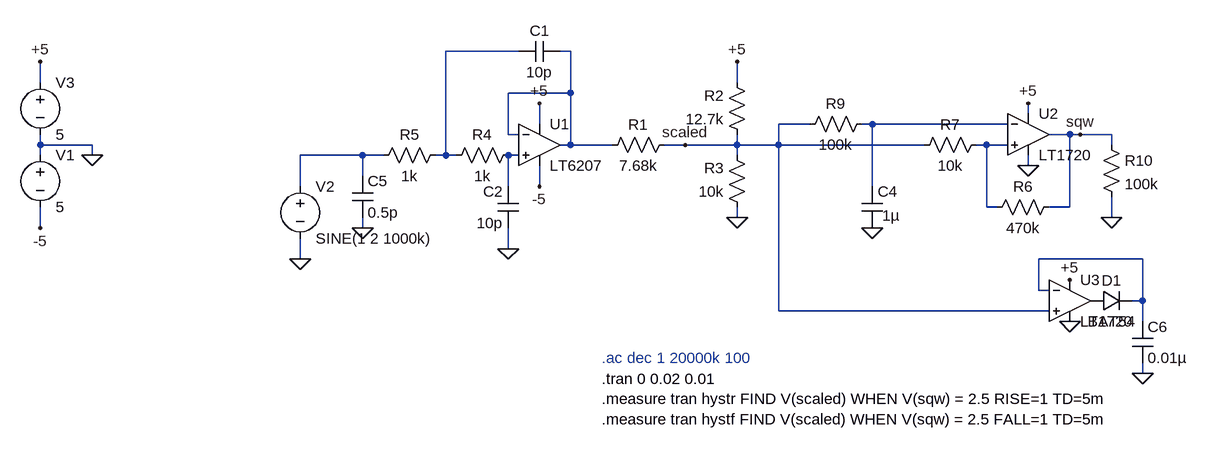
[diagram p0: schematic tsunami input stage.asc]
tsunami input stage.asc, the LTspice schematic file:
Version 4
SHEET 1 1596 724
WIRE 560 160 448 160
WIRE 640 160 624 160
WIRE -176 208 -176 176
WIRE 896 208 896 176
WIRE 640 224 640 160
WIRE 640 224 544 224
WIRE 1344 256 1344 240
WIRE 592 272 592 240
WIRE 1008 272 960 272
WIRE 1104 272 1088 272
WIRE 1312 272 1104 272
WIRE 544 288 544 224
WIRE 560 288 544 288
WIRE 1408 288 1376 288
WIRE 1424 288 1408 288
WIRE 1472 288 1424 288
WIRE -176 304 -176 288
WIRE -96 304 -176 304
WIRE 640 304 640 224
WIRE 640 304 624 304
WIRE 704 304 640 304
WIRE 816 304 784 304
WIRE 896 304 896 288
WIRE 896 304 816 304
WIRE 960 304 960 272
WIRE 960 304 896 304
WIRE 1184 304 960 304
WIRE 1280 304 1264 304
WIRE 1312 304 1280 304
WIRE 1472 304 1472 288
WIRE -176 320 -176 304
WIRE -96 320 -96 304
WIRE 320 320 224 320
WIRE 352 320 320 320
WIRE 448 320 448 160
WIRE 448 320 432 320
WIRE 464 320 448 320
WIRE 560 320 544 320
WIRE 896 320 896 304
WIRE 1344 336 1344 320
WIRE 320 352 320 320
WIRE 224 368 224 320
WIRE 544 368 544 320
WIRE 592 368 592 336
WIRE 1104 368 1104 272
WIRE 1280 400 1280 304
WIRE 1296 400 1280 400
WIRE 1408 400 1408 288
WIRE 1408 400 1376 400
WIRE 896 416 896 400
WIRE 1472 416 1472 384
WIRE -176 432 -176 400
WIRE 320 432 320 416
WIRE 544 464 544 432
WIRE 224 480 224 448
WIRE 1520 480 1360 480
WIRE 1360 528 1360 480
WIRE 1376 528 1360 528
WIRE 1520 544 1520 480
WIRE 1520 544 1504 544
WIRE 960 560 960 304
WIRE 1376 560 960 560
WIRE 1520 576 1520 544
WIRE 1520 656 1520 640
FLAG 224 480 0
FLAG 896 416 0
FLAG -176 176 +5
FLAG -176 432 -5
FLAG -96 320 0
FLAG 896 176 +5
FLAG 592 240 +5
FLAG 592 368 -5
FLAG 544 464 0
FLAG 1344 240 +5
FLAG 1344 336 0
FLAG 1104 432 0
FLAG 1472 416 0
FLAG 320 432 0
FLAG 1520 656 0
FLAG 1408 512 +5
FLAG 1408 576 0
FLAG 816 304 scaled
FLAG 1424 288 sqw
SYMBOL voltage 224 352 R0
SYMATTR InstName V2
SYMATTR Value SINE(1 2 1000k)
SYMATTR Value2 AC 3
SYMBOL res 800 288 R90
WINDOW 0 0 56 VBottom 2
WINDOW 3 32 56 VTop 2
SYMATTR InstName R1
SYMATTR Value 7.68k
SYMBOL res 912 304 R180
WINDOW 0 36 76 Left 2
WINDOW 3 36 40 Left 2
SYMATTR InstName R2
SYMATTR Value 12.7k
SYMBOL res 912 416 R180
WINDOW 0 36 76 Left 2
WINDOW 3 36 40 Left 2
SYMATTR InstName R3
SYMATTR Value 10k
SYMBOL voltage -176 304 R0
SYMATTR InstName V1
SYMATTR Value 5
SYMBOL voltage -176 192 R0
SYMATTR InstName V3
SYMATTR Value 5
SYMBOL Opamps/LT6207 592 304 R0
SYMATTR InstName U1
SYMBOL res 560 304 R90
WINDOW 0 0 56 VBottom 2
WINDOW 3 32 56 VTop 2
SYMATTR InstName R4
SYMATTR Value 1k
SYMBOL res 448 304 R90
WINDOW 0 0 56 VBottom 2
WINDOW 3 32 56 VTop 2
SYMATTR InstName R5
SYMATTR Value 1k
SYMBOL cap 624 144 R90
WINDOW 0 0 32 VBottom 2
WINDOW 3 32 32 VTop 2
SYMATTR InstName C1
SYMATTR Value 10p
SYMBOL cap 560 432 R180
WINDOW 0 24 56 Left 2
WINDOW 3 24 8 Left 2
SYMATTR InstName C2
SYMATTR Value 10p
SYMBOL Comparators/LT1720 1344 224 R0
SYMATTR InstName U2
SYMBOL res 992 288 R270
WINDOW 0 32 56 VTop 2
WINDOW 3 0 56 VBottom 2
SYMATTR InstName R9
SYMATTR Value 100k
SYMBOL res 1456 288 R0
SYMATTR InstName R10
SYMATTR Value 100k
SYMBOL cap 1088 368 R0
WINDOW 3 31 45 Left 2
SYMATTR Value 1µ
SYMATTR InstName C4
SYMBOL cap 304 352 R0
SYMATTR InstName C5
SYMATTR Value 0.5p
SYMBOL diode 1440 560 R270
WINDOW 0 32 32 VTop 2
WINDOW 3 0 32 VBottom 2
SYMATTR InstName D1
SYMATTR Value BAT54
SYMBOL cap 1504 576 R0
SYMATTR InstName C6
SYMATTR Value 0.01µ
SYMATTR SpiceLine Rpar=10000k
SYMBOL res 1392 384 R90
WINDOW 0 0 56 VBottom 2
WINDOW 3 32 56 VTop 2
SYMATTR InstName R6
SYMATTR Value 470k
SYMBOL res 1280 288 R90
WINDOW 0 0 56 VBottom 2
WINDOW 3 32 56 VTop 2
SYMATTR InstName R7
SYMATTR Value 10k
SYMBOL Comparators/LT1720 1408 480 R0
SYMATTR InstName U3
TEXT 688 632 Left 2 ;.ac dec 1 20000k 100
TEXT 688 664 Left 2 !.tran 0 0.02 0.01\n.measure tran hystr FIND V(scaled) WHEN V(sqw) = 2.5 RISE=1 TD=5m\n.measure tran hystf FIND V(scaled) WHEN V(sqw) = 2.5 FALL=1 TD=5m

The netlist it stands for:
* tsunami input stage.asc
V2 N005 0 SINE(1 2 1000k) AC 3
R1 scaled N002 7.68k
R2 scaled +5 12.7k
R3 0 scaled 10k
V1 0 -5 5
V3 +5 0 5
XU1 N006 N002 N002 +5 -5 LT6205  ; LT6207, pins In+ In- OUT V+ V-
R4 N006 N001 1k
R5 N001 N005 1k
C1 N002 N001 10p
C2 0 N006 10p
XU2 N004 N003 +5 0 sqw LT1720  ; pins In+ In- V+ V- OUT
R9 scaled N003 100k
R10 sqw 0 100k
C4 N003 0 1µ
C5 N005 0 0.5p
D1 P001 N007 BAT54
C6 N007 0 0.01µ Rpar=10000k
R6 sqw N004 470k
R7 N004 scaled 10k
XU3 scaled N007 +5 0 P001 LT1720  ; pins In+ In- V+ V- OUT
.model D D
.lib standard.dio
* .ac dec 1 20000k 100
.tran 0 0.02 0.01
.measure tran hystr FIND V(scaled) WHEN V(sqw) = 2.5 RISE=1 TD=5m
.measure tran hystf FIND V(scaled) WHEN V(sqw) = 2.5 FALL=1 TD=5m
.lib LTC2.lib
.lib LT1720.sub
.backanno
.end